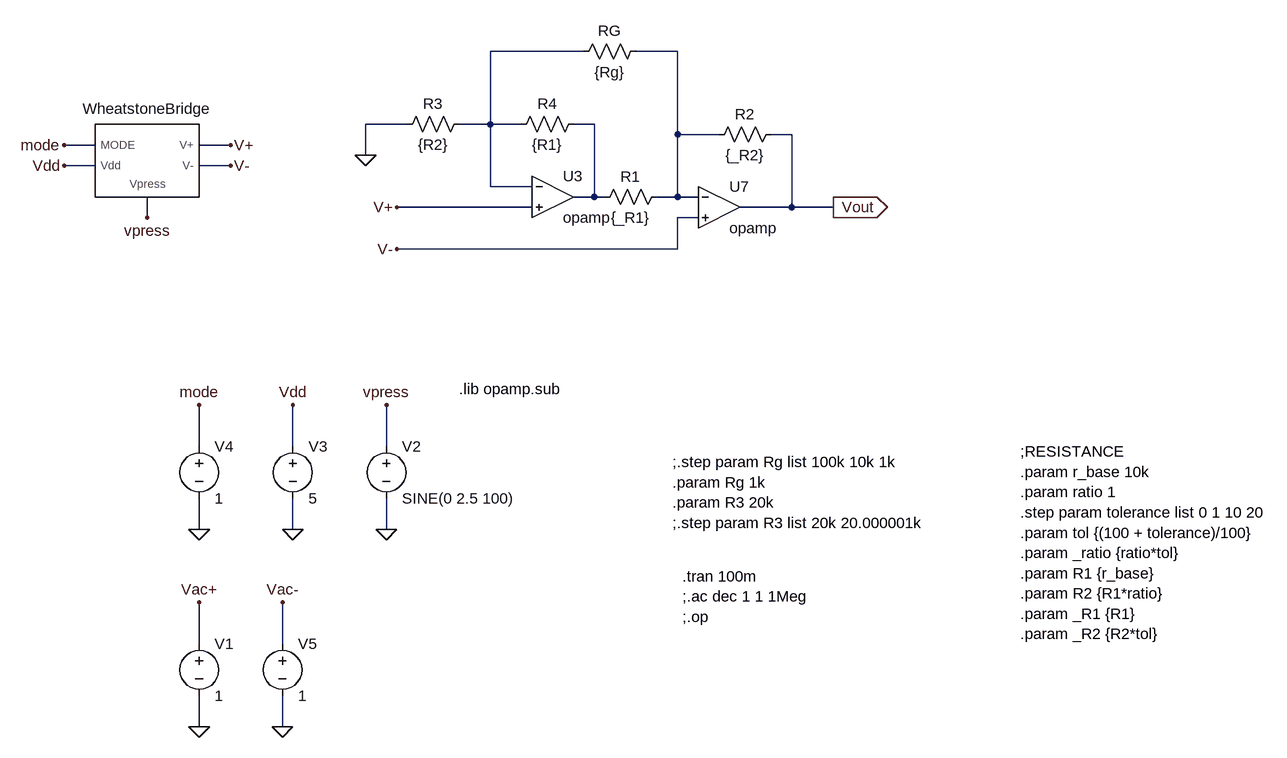
[diagram p0: schematic PZR_INA2.asc]
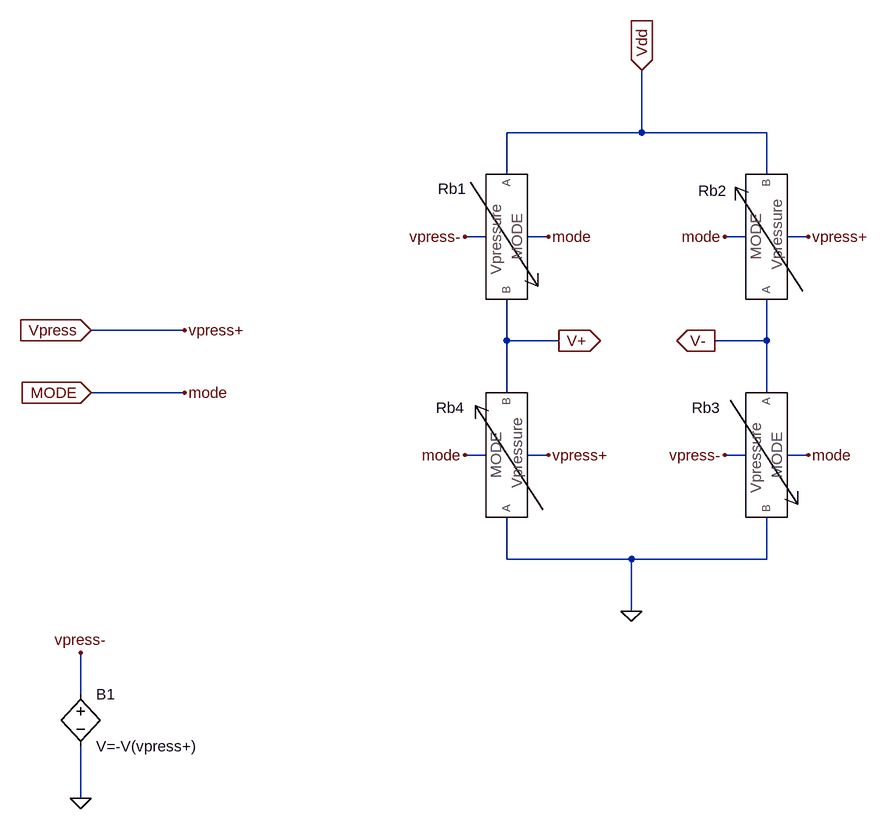
[diagram p1: sub-circuit com_wheatstone.asc]
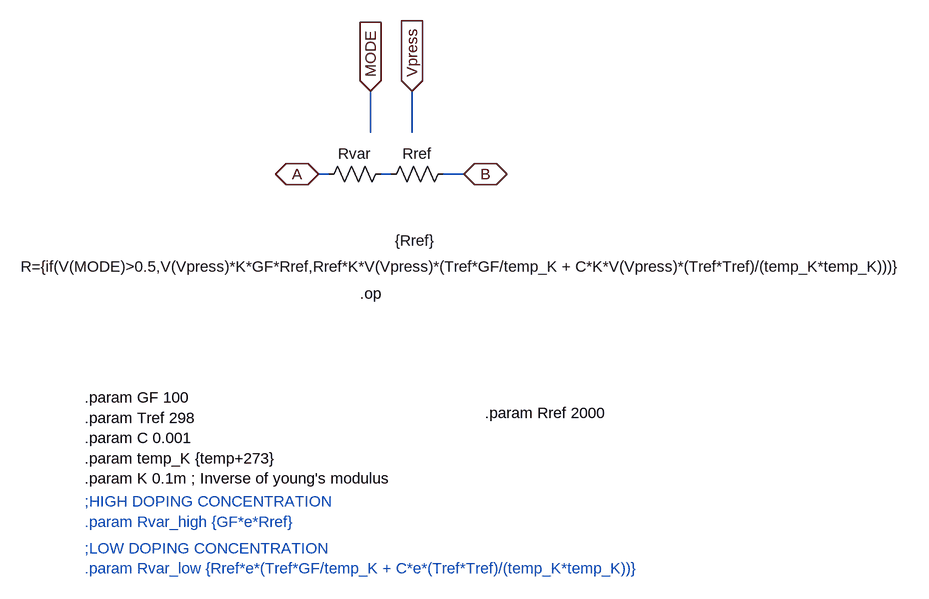
[diagram p2: sub-circuit sensor_res.asc]
PZR_INA2.asc, the LTspice schematic file:
Version 4
SHEET 1 3044 1216
WIRE 384 160 240 160
WIRE 528 160 464 160
WIRE 112 272 48 272
WIRE 240 272 240 160
WIRE 240 272 192 272
WIRE 288 272 240 272
WIRE 400 272 368 272
WIRE 528 288 528 160
WIRE 592 288 528 288
WIRE 704 288 672 288
WIRE -368 304 -416 304
WIRE -160 304 -208 304
WIRE 48 320 48 272
WIRE -368 336 -416 336
WIRE -160 336 -208 336
WIRE 240 368 240 272
WIRE 304 368 240 368
WIRE 400 384 400 272
WIRE 400 384 368 384
WIRE 416 384 400 384
WIRE 528 384 528 288
WIRE 528 384 496 384
WIRE 560 384 528 384
WIRE 304 400 96 400
WIRE 704 400 704 288
WIRE 704 400 624 400
WIRE 768 400 704 400
WIRE -288 416 -288 384
WIRE 560 416 528 416
WIRE 528 464 528 416
WIRE 528 464 96 464
WIRE -208 768 -208 704
WIRE -64 768 -64 704
WIRE 80 768 80 704
WIRE -208 896 -208 848
WIRE -64 896 -64 848
WIRE 80 896 80 848
WIRE -208 1072 -208 1008
WIRE -80 1072 -80 1008
WIRE -208 1200 -208 1152
WIRE -80 1200 -80 1152
FLAG 80 896 0
FLAG -64 896 0
FLAG -208 896 0
FLAG -64 704 Vdd
FLAG -208 704 mode
FLAG 80 704 vpress
FLAG 48 320 0
FLAG 96 464 V-
FLAG 96 400 V+
FLAG 768 400 Vout
IOPIN 768 400 Out
FLAG -208 1200 0
FLAG -208 1008 Vac+
FLAG -288 416 vpress
FLAG -416 336 Vdd
FLAG -416 304 mode
FLAG -160 304 V+
FLAG -160 336 V-
FLAG -80 1200 0
FLAG -80 1008 Vac-
SYMBOL voltage 80 752 R0
SYMATTR InstName V2
SYMATTR Value SINE(0 2.5 100)
SYMATTR Value2 AC 1
SYMBOL voltage -64 752 R0
SYMATTR InstName V3
SYMATTR Value 5
SYMBOL voltage -208 752 R0
SYMATTR InstName V4
SYMATTR Value 1
SYMBOL Opamps/opamp 336 320 R0
SYMATTR InstName U3
SYMBOL Opamps/opamp 592 336 R0
SYMATTR InstName U7
SYMBOL res 400 400 R270
WINDOW 0 32 56 VTop 2
WINDOW 3 0 56 VBottom 2
SYMATTR InstName R1
SYMATTR Value {_R1}
SYMBOL res 272 288 R270
WINDOW 0 32 56 VTop 2
WINDOW 3 0 56 VBottom 2
SYMATTR InstName R4
SYMATTR Value {R1}
SYMBOL res 368 176 R270
WINDOW 0 32 56 VTop 2
WINDOW 3 0 56 VBottom 2
SYMATTR InstName RG
SYMATTR Value {Rg}
SYMBOL res 688 272 R90
WINDOW 0 0 56 VBottom 2
WINDOW 3 32 56 VTop 2
SYMATTR InstName R2
SYMATTR Value {_R2}
SYMBOL res 208 256 R90
WINDOW 0 0 56 VBottom 2
WINDOW 3 32 56 VTop 2
SYMATTR InstName R3
SYMATTR Value {R2}
SYMBOL voltage -208 1056 R0
SYMATTR InstName V1
SYMATTR Value 1
SYMATTR Value2 AC 1
SYMBOL COM_WHEATSTONE -288 320 R0
SYMATTR InstName WheatstoneBridge
SYMBOL voltage -80 1056 R0
SYMATTR InstName V5
SYMATTR Value 1
SYMATTR Value2 AC 1 180
TEXT 192 680 Left 2 !.lib opamp.sub
TEXT 536 968 Left 2 !.tran 100m\n;.ac dec 1 1 1Meg\n;.op
TEXT 520 792 Left 2 !;.step param Rg list 100k 10k 1k\n.param Rg 1k\n.param R3 20k\n;.step param R3 list 20k 20.000001k
TEXT 1056 776 Left 2 !;RESISTANCE\n.param r_base 10k\n.param ratio 1\n.step param tolerance list 0 1 10 20\n.param tol {(100 + tolerance)/100}\n.param _ratio {ratio*tol}\n.param R1 {r_base}\n.param R2 {R1*ratio}\n.param _R1 {R1}\n.param _R2 {R2*tol}

com_wheatstone.asc, the sub-circuit schematic file:
Version 4
SHEET 1 1064 1200
WIRE 448 112 448 16
WIRE 448 112 240 112
WIRE 640 112 448 112
WIRE 240 176 240 112
WIRE 640 176 640 112
WIRE 208 272 176 272
WIRE 304 272 272 272
WIRE 608 272 576 272
WIRE 704 272 672 272
WIRE -256 416 -400 416
WIRE 240 432 240 368
WIRE 320 432 240 432
WIRE 640 432 640 368
WIRE 640 432 560 432
WIRE -256 512 -400 512
WIRE 240 512 240 432
WIRE 640 512 640 432
WIRE 208 608 176 608
WIRE 304 608 272 608
WIRE 608 608 576 608
WIRE 704 608 672 608
WIRE 240 768 240 704
WIRE 432 768 240 768
WIRE 640 768 640 704
WIRE 640 768 432 768
WIRE 432 848 432 768
WIRE -416 976 -416 912
WIRE -416 1136 -416 1056
FLAG 432 848 0
FLAG 176 608 mode
FLAG 304 272 mode
FLAG 704 608 mode
FLAG 576 272 mode
FLAG 304 608 vpress+
FLAG 704 272 vpress+
FLAG 576 608 vpress-
FLAG 176 272 vpress-
FLAG 448 16 Vdd
IOPIN 448 16 In
FLAG 320 432 V+
IOPIN 320 432 Out
FLAG 560 432 V-
IOPIN 560 432 Out
FLAG -416 1136 0
FLAG -416 912 vpress-
FLAG -400 416 Vpress
IOPIN -400 416 In
FLAG -256 416 vpress+
FLAG -400 512 MODE
IOPIN -400 512 In
FLAG -256 512 mode
SYMBOL SENSOR_RES 224 608 R270
WINDOW 0 57 -71 VTop 2
SYMATTR InstName Rb4
SYMBOL SENSOR_RES 656 608 R90
WINDOW 0 -88 109 VTop 2
SYMATTR InstName Rb3
SYMBOL SENSOR_RES 256 272 R90
WINDOW 0 -89 100 VTop 2
SYMATTR InstName Rb1
SYMBOL SENSOR_RES 624 272 R270
WINDOW 0 55 -67 VTop 2
SYMATTR InstName Rb2
SYMBOL bv -416 960 R0
SYMATTR InstName B1
SYMATTR Value V=-V(vpress+)

sensor_res.asc, the sub-circuit schematic file:
Version 4
SHEET 1 1248 1508
WIRE 400 272 400 208
WIRE 464 272 464 208
WIRE 336 336 320 336
WIRE 432 336 416 336
WIRE 544 336 512 336
FLAG 464 208 Vpress
IOPIN 464 208 In
FLAG 400 208 MODE
IOPIN 400 208 In
FLAG 320 336 A
IOPIN 320 336 BiDir
FLAG 544 336 B
IOPIN 544 336 BiDir
SYMBOL res 432 320 R90
WINDOW 0 0 56 VBottom 2
WINDOW 3 143 -113 VTop 2
SYMATTR InstName Rvar
SYMATTR Value R={if(V(MODE)>0.5,V(Vpress)*K*GF*Rref,Rref*K*V(Vpress)*(Tref*GF/temp_K + C*K*V(Vpress)*(Tref*Tref)/(temp_K*temp_K)))}
SYMBOL res 528 320 R90
WINDOW 0 0 56 VBottom 2
WINDOW 3 103 59 VTop 2
SYMATTR InstName Rref
SYMATTR Value {Rref}
TEXT -40 680 Left 2 !.param GF 100\n.param Tref 298\n.param C 0.001\n.param temp_K {temp+273}\n.param K 0.1m ; Inverse of young's modulus
TEXT -40 912 Left 2 ;;LOW DOPING CONCENTRATION\n.param Rvar_low {Rref*e*(Tref*GF/temp_K + C*e*(Tref*Tref)/(temp_K*temp_K))}
TEXT -40 840 Left 2 ;;HIGH DOPING CONCENTRATION\n.param Rvar_high {GF*e*Rref}
TEXT 576 704 Left 2 !.param Rref 2000
TEXT 384 520 Left 2 !.op

The netlist it stands for:
* PZR_INA2.asc
V2 vpress 0 SINE(0 2.5 100) AC 1
V3 Vdd 0 5
V4 mode 0 1
XU3 N001 V+ N003 opamp Aol=100K GBW=10Meg  ; pins invin noninvin out
XU7 N002 V- Vout opamp Aol=100K GBW=10Meg  ; pins invin noninvin out
R1 N003 N002 {_R1}
R4 N001 N003 {R1}
RG N001 N002 {Rg}
R2 Vout N002 {_R2}
R3 N001 0 {R2}
V1 Vac+ 0 1 AC 1
XWheatstoneBridge mode Vdd vpress V+ V- com_wheatstone
V5 Vac- 0 1 AC 1 180

* block symbol definitions
.subckt com_wheatstone MODE Vdd Vpress V+ V-
XRb4 mode Vpress 0 V+ sensor_res
XRb3 mode vpress- V- 0 sensor_res
XRb1 mode vpress- Vdd V+ sensor_res
XRb2 mode Vpress V- Vdd sensor_res
B1 vpress- 0 V=-V(vpress+)
.ends com_wheatstone

.subckt sensor_res MODE Vpress A B
Rvar N001 A R={if(V(MODE)>0.5,V(Vpress)*K*GF*Rref,Rref*K*V(Vpress)*(Tref*GF/temp_K + C*K*V(Vpress)*(Tref*Tref)/(temp_K*temp_K)))}
Rref B N001 {Rref}
.param GF 100
.param Tref 298
.param C 0.001
.param temp_K {temp+273}
.param K 0.1m ; Inverse of young's modulus
* ;LOW DOPING CONCENTRATION
* .param Rvar_low {Rref*e*(Tref*GF/temp_K + C*e*(Tref*Tref)/(temp_K*temp_K))}
* ;HIGH DOPING CONCENTRATION
* .param Rvar_high {GF*e*Rref}
.param Rref 2000
.op
.ends sensor_res

.lib opamp.sub
.tran 100m
;.ac dec 1 1 1Meg
;.op
;.step param Rg list 100k 10k 1k
.param Rg 1k
.param R3 20k
;.step param R3 list 20k 20.000001k
;RESISTANCE
.param r_base 10k
.param ratio 1
.step param tolerance list 0 1 10 20
.param tol {(100 + tolerance)/100}
.param _ratio {ratio*tol}
.param R1 {r_base}
.param R2 {R1*ratio}
.param _R1 {R1}
.param _R2 {R2*tol}
.backanno
.end